# Altium schematic sheet Heating.SchDoc
size A4; SheetNumber: 2; SheetTotal: 5
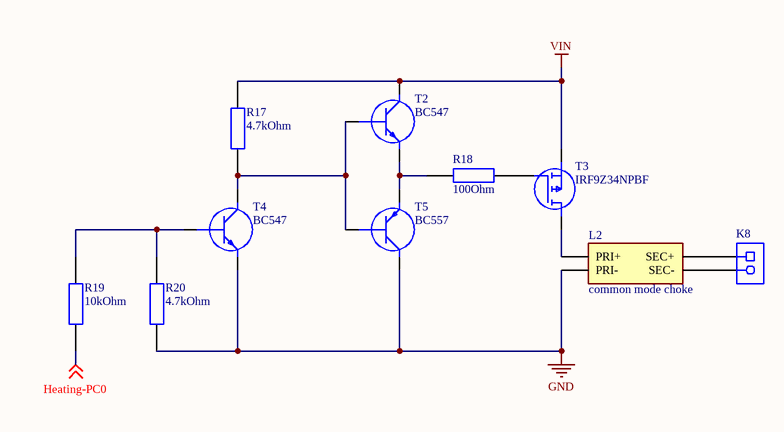
[diagram p0: Heating.SchDoc]

## Parts
K8  1729128  [2-pin terminal block]  (value not drawn)
L2  common mode choke  [common mode choke]
R17  4.7kOhm  [resistor]
R18  100Ohm  [resistor]
R19  10kOhm  [resistor]
R20  4.7kOhm  [resistor]
T2  BC547  [BC547CBU]
T3  IRF9Z34NPBF  [TO254P469X1042X1967-3P]
T4  BC547  [BC547CBU]
T5  BC557  [BC33740TA]

## Nets
GND: L2.4(PRI-) R20.1 T4.3(E) T5.1(C)
VIN: R17.2 T2.1(C) T3.2(S)
Heating-PC0: R19.2 ; off-sheet Heating-PC0
NetK8_1: K8.1 L2.2(SEC+)
NetK8_2: K8.2 L2.3(SEC-)
NetL2_1: L2.1(PRI+) T3.3(D)
NetR17_1: R17.1 T2.2(B) T4.1(C) T5.2(B)
NetR18_1: R18.1 T2.3(E) T5.3(E)
NetR18_2: R18.2 T3.1(G)
NetR19_1: R19.1 R20.2 T4.2(B)

## Library data of the parts
K8 = MKDSN 1,5/ 2-5,08: PCB Terminal Block, 13.5 A, 400 V, 2-Pin THD, RoHS, Bulk; Manufacturer: Phoenix Contact; Package Version: 03/2015; No. of Rows: 1; Pitch: 5.08mm; No. of Positions: 2; Voltage Rating: 400V; Current Rating: 13500mA; Manufacturer URL: http://www.phoenixcontact.com/; Datasheet URL: https://datasheet.ciiva.com/16046/1729128-16046181.pdf; RoHS: TRUE; Package URL: https://www.phoenixcontact.com/online/portal/pi/pxc/product_detail_page/!ut/p/b1/3VdJjqNKFDxLH8AFycySyWY2ozFsEPOMMQaDOX1XedGL_1Vdm5YXJleknhSKeBkvI6EA8ncAo3AYoDhBQGco6KN7VURTdemj9us_IEKEZo_YHiPAEWEFmDGOHMORkqKYCORBZxgL7ZoaZYcbFFUZ3fqxSY6GOuxydWUuHqz1ynmMFygu583Bob0Ewr6Sd_l-5m-kAueHiB0jpRwZwe58wwtkpxtMYd_LmGcDRU02dRNEyWt6Y2ti5pSyJ_reIkzIulrqApdnbT11V5jnCKbYNCvhEM1MCpPByat_X379-iThf08CI5GfOPqfBeS3BRoBOdD55AKVv0iLwCMq-2BrzXWSGRH7pUGD9uwXQjiph3xL0DKQwdGa0JImiIOmBNOestqgwTHSSs2oOep-78apyXQBvNi8ZLaFjvjWvcaUEBu0MC6Wbe-d6mB0FAebo2lUWinqYaZs5DAYzV0RP9yitUjnGJ0iI9xhZkT42OCQNUJJhkgWINNQLP2JFP6OpMg3JCVg70jqHT0lvKOnhHf0lPuOnnLf0VPuWx6_dxwUIvwk5WMkT0kLL1mh61l2yZVSzG3pYV_bqo-mj6uMKwKwdnnW8Jh5RTOJzMOA5c-eJDaZQw4mTMPH02PvS_ZAqNVjVTo2WyYLkwH_KU1mmmG5kjRhDqPXLwwVHvVOjCM60-fpXvTDfMGW1PVFVS1r4e4yVDk4ZdNbkUHvqPqQSeian4UD39fNKmachqdJ1NJbyk8rXT9mXTvPk3oE5meulKGgiruPJek-4I9hTT6G8ZLOyRSm2RRVbThERQad5OS28hdt4YW4vG0stgYYzsWsK4_7y6DZMjJSCqri1kyiZR5vD7pwIrNR7QwPHTcLTI5qT7eRlpHrdGiupYlqQDJ7zy_CND8fWWBoLRXxk1RVcXiBQwbTD4Xi7KL-FuO94t9xaqweXzH; PartNumber: 1729128; Package Description: 2-Pin Through Hole Device, Body 8.1 x 10.16 mm, Pitch 5.08 mm; Datasheet Version: 12/2013; Mounting Technology: ThroughHole; Orientation: Horizontal; Package Reference: 1729128-2; Packing: Bulk
L2 = common mode choke: Inductor; Manufacturer_Name: Laird Technologies; Manufacturer_Part_Number: CM2545X171B-10; Datasheet Link: https://datasheet.datasheetarchive.com/originals/dk/DKDS-7/122753.pdf; Height: 9.5mm
R17 R20 = 4.7kOhm resistor: Resistor; Manufacturer_Name: YAGEO (PHYCOMP); Manufacturer_Part_Number: CFR-25JT-52-4K7; Datasheet Link: https://componentsearchengine.com//CFR-25JT-52-4K7.pdf; Mouser2 Part Number: 603-CFR-25JT-52-4K7; Mouser2 Price/Stock: https://www.mouser.com/Search/Refine.aspx?Keyword=603-CFR-25JT-52-4K7
R18 = 100Ohm resistor: Resistor; Manufacturer_Name: YAGEO (PHYCOMP); Manufacturer_Part_Number: CFR-25JR-52-100R; Datasheet Link: https://componentsearchengine.com//CFR-25JR-52-100R.pdf; Mouser2 Part Number: 603-CFR-25JR-52100R; Mouser2 Price/Stock: https://www.mouser.com/Search/Refine.aspx?Keyword=603-CFR-25JR-52100R
R19 = 10kOhm resistor: Resistor; Manufacturer_Name: YAGEO (PHYCOMP); Manufacturer_Part_Number: CFR-25JT-52-10K
T2 T4 = BC547: Transistor BJT NPN; Manufacturer_Name: ON Semiconductor; Datasheet Link: https://www.onsemi.com/pdf/datasheet/bc550-d.pdf; Height: 5.33mm; Manufacturer_Part_Number: BC547CBU
T3 = IRF9Z34NPBF: MOSFET (P-Channel); Manufacturer_Name: Infineon; Datasheet Link: https://componentsearchengine.com//IRF9Z34NPBF.pdf; Height: 4.69mm; Mouser2 Part Number: 942-IRF9Z34NPBF; Mouser2 Price/Stock: https://www.mouser.com/Search/Refine.aspx?Keyword=942-IRF9Z34NPBF; Manufacturer_Part_Number: IRF9Z34NPBF
T5 = BC557: Transistor BJT PNP; Manufacturer_Name: ON Semiconductor; Manufacturer_Part_Number: BC557ATA; Datasheet Link: https://componentsearchengine.com//BC557ATA.pdf; Mouser2 Part Number: 512-BC557ATA; Mouser2 Price/Stock: https://www.mouser.com/Search/Refine.aspx?Keyword=512-BC557ATA